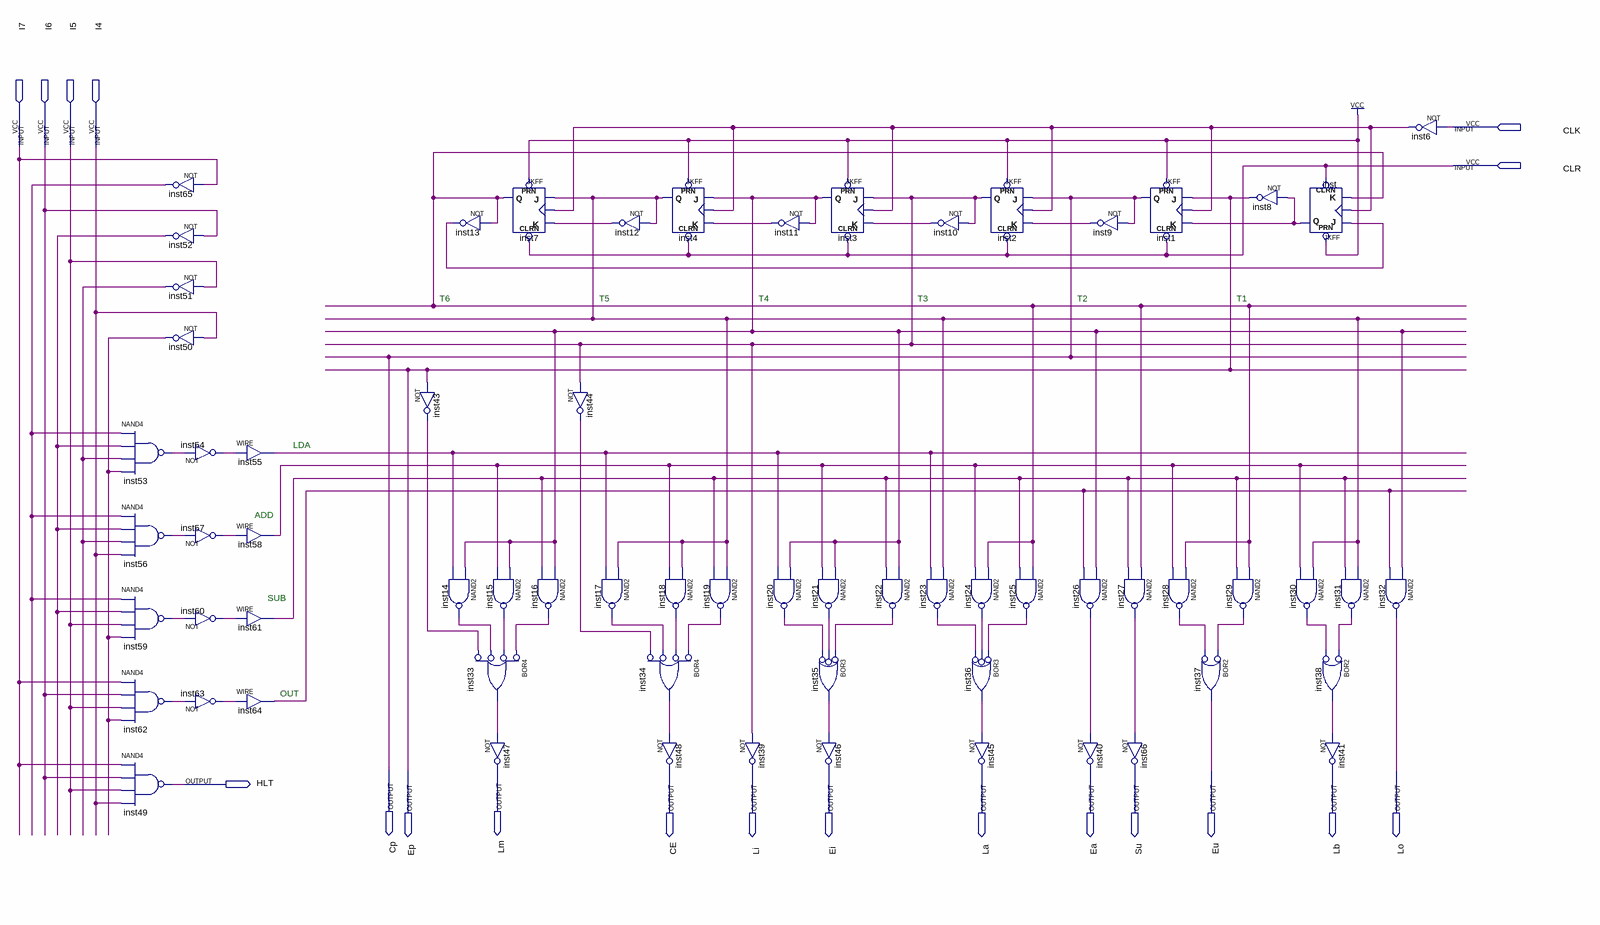
[diagram p0: schematic sheet]
// Quartus schematic sequencer.bdf as structural Verilog: 65 symbols, 19 pins
module sequencer (
  input  CLK,
  input  I7,
  input  I6,
  input  I5,
  input  I4,
  input  CLR,
  output Cp,
  output Ep,
  output Lm,
  output CE,
  output Li,
  output Ei,
  output La,
  output Ea,
  output Su,
  output Eu,
  output Lb,
  output Lo,
  output HLT
);

  wire inst2_q, inst3_q, inst4_q, inst6_out, inst7_q, inst9_out, inst10_out, inst11_out, inst12_out,
       inst13_out, inst14_out, inst15_out, inst16_out, inst17_out, inst18_out, inst19_out, inst20_out,
       inst21_out, inst22_out, inst23_out, inst24_out, inst25_out, inst26_out, inst27_out, inst28_out,
       inst29_out, inst30_out, inst31_out, inst33_out, inst34_out, inst35_out, inst36_out, inst38_out,
       inst43_out, inst44_out, inst50_out, inst51_out, inst52_out, inst53_out, inst54_out, inst55_out,
       inst56_out, inst57_out, inst58_out, inst59_out, inst60_out, inst61_out, inst62_out, inst63_out,
       inst64_out, inst65_out, inst_q;

  nand inst53 (inst53_out, inst65_out, inst52_out, inst51_out, inst50_out);
  nand inst56 (inst56_out, inst65_out, inst52_out, inst51_out, I4);
  nand inst59 (inst59_out, inst65_out, inst52_out, I5, inst50_out);
  nand inst62 (inst62_out, I7, I6, I5, inst50_out);
  nand inst49 (HLT, I7, I6, I5, I4);
  not inst65 (inst65_out, I7);
  not inst52 (inst52_out, I6);
  not inst51 (inst51_out, I5);
  not inst50 (inst50_out, I4);
  not inst54 (inst54_out, inst53_out);
  not inst57 (inst57_out, inst56_out);
  not inst60 (inst60_out, inst59_out);
  not inst63 (inst63_out, inst62_out);
  assign inst55_out = inst54_out;  // WIRE inst55
  assign inst58_out = inst57_out;  // WIRE inst58
  assign inst61_out = inst60_out;  // WIRE inst61
  assign inst64_out = inst63_out;  // WIRE inst64
  not inst13 (inst13_out, inst7_q);
  not inst43 (inst43_out, Ep);
  nand inst14 (inst14_out, inst3_q, inst55_out);
  JKFF inst7 (.PRN(1'b1), .CLRN(CLR), .K(inst12_out), .J(inst4_q), .CLK(inst6_out), .Q(inst7_q));
  nand inst15 (inst15_out, inst3_q, inst58_out);
  or inst33 (inst33_out, ~inst16_out, ~inst15_out, ~inst14_out, ~inst43_out);  // BOR4
  not inst47 (Lm, inst33_out);
  nand inst16 (inst16_out, inst3_q, inst61_out);
  not inst12 (inst12_out, inst4_q);
  not inst44 (inst44_out, inst2_q);
  nand inst17 (inst17_out, inst4_q, inst55_out);
  JKFF inst4 (.PRN(1'b1), .CLRN(CLR), .K(inst11_out), .J(inst3_q), .CLK(inst6_out), .Q(inst4_q));
  nand inst18 (inst18_out, inst4_q, inst58_out);
  or inst34 (inst34_out, ~inst19_out, ~inst18_out, ~inst17_out, ~inst44_out);  // BOR4
  not inst48 (CE, inst34_out);
  nand inst19 (inst19_out, inst4_q, inst61_out);
  nand inst20 (inst20_out, inst3_q, inst55_out);
  not inst39 (Li, inst2_q);
  not inst11 (inst11_out, inst3_q);
  nand inst21 (inst21_out, inst3_q, inst58_out);
  or inst35 (inst35_out, ~inst22_out, ~inst21_out, ~inst20_out);  // BOR3
  not inst46 (Ei, inst35_out);
  JKFF inst3 (.PRN(1'b1), .CLRN(CLR), .K(inst10_out), .J(inst2_q), .CLK(inst6_out), .Q(inst3_q));
  nand inst22 (inst22_out, inst3_q, inst61_out);
  nand inst23 (inst23_out, inst4_q, inst55_out);
  not inst10 (inst10_out, inst2_q);
  nand inst24 (inst24_out, inst7_q, inst58_out);
  or inst36 (inst36_out, ~inst25_out, ~inst24_out, ~inst23_out);  // BOR3
  not inst45 (La, inst36_out);
  JKFF inst2 (.PRN(1'b1), .CLRN(CLR), .K(inst9_out), .J(Cp), .CLK(inst6_out), .Q(inst2_q));
  nand inst25 (inst25_out, inst7_q, inst61_out);
  nand inst26 (inst26_out, inst3_q, inst64_out);
  not inst9 (inst9_out, Cp);
  nand inst27 (inst27_out, inst7_q, inst61_out);
  not inst40 (Ea, inst26_out);
  not inst66 (Su, inst27_out);
  JKFF inst1 (.PRN(1'b1), .CLRN(CLR), .K(inst_q), .J(Ep), .CLK(inst6_out), .Q(Cp));
  nand inst28 (inst28_out, inst7_q, inst58_out);
  nand inst29 (inst29_out, inst7_q, inst61_out);
  or inst37 (Eu, ~inst29_out, ~inst28_out);  // BOR2
  not inst8 (Ep, inst_q);
  JKFF inst (.PRN(1'b1), .CLRN(CLR), .K(inst7_q), .J(inst13_out), .CLK(inst6_out), .Q(inst_q));
  nand inst30 (inst30_out, inst4_q, inst58_out);
  or inst38 (inst38_out, ~inst31_out, ~inst30_out);  // BOR2
  not inst41 (Lb, inst38_out);
  nand inst31 (inst31_out, inst4_q, inst61_out);
  nand inst32 (Lo, inst3_q, inst64_out);
  not inst6 (inst6_out, CLK);

  // Notes on the sheet:
  //   T6
  //   T5
  //   T4
  //   T3
  //   T2
  //   T1
  //   LDA
  //   ADD
  //   SUB
  //   OUT
endmodule
